# EAGLE design madaq_filter_panel (EAGLE 7.2.0)
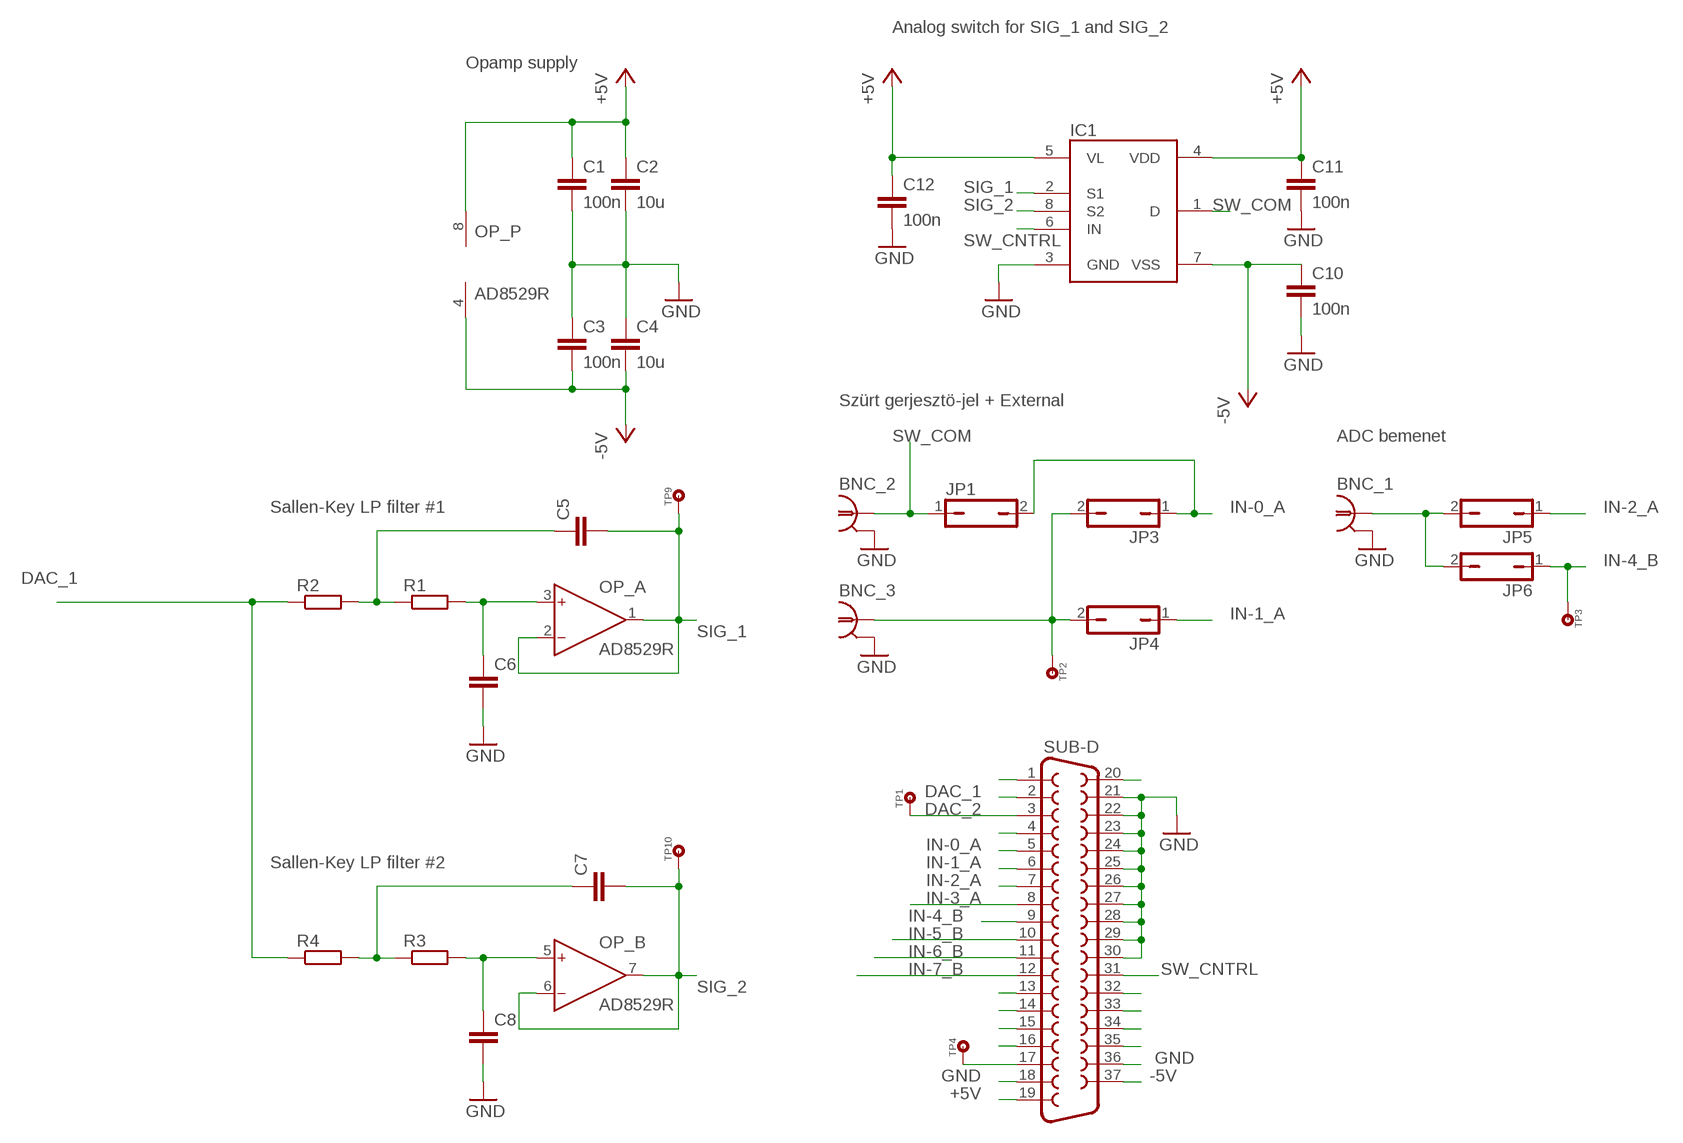
[diagram p0: schematic, sheet 1]

## Parts
BNC_1  BNC-ISOL-90I  [BNCPCB90I]
BNC_2  BNC-ISOL-90I  [BNCPCB90I]
BNC_3  BNC-ISOL-90I  [BNCPCB90I]
C1  100n  C1206  [C1206]
C2  10u  C1206  [C1206]
C3  100n  C1206  [C1206]
C4  10u  C1206  [C1206]
C5  C1206  [C1206]
C6  C1206  [C1206]
C7  C1206  [C1206]
C8  C1206  [C1206]
C10  100n  C1206  [C1206]
C11  100n  C1206  [C1206]
C12  100n  C1206  [C1206]
IC1  ADG419BR  [SO08]
JP1  JP1Q  [JP1]
JP3  JP1Q  [JP1]
JP4  JP1Q  [JP1]
JP5  JP1Q  [JP1]
JP6  JP1Q  [JP1]
OP_  AD8529R  [SO8]
R1  R1206  [R1206]
R2  R1206  [R1206]
R3  R1206  [R1206]
R4  R1206  [R1206]
SUB-D  F37HP  [F37HP]
TP1  TP  [JP1]
TP2  TP  [JP1]
TP3  TP  [JP1]
TP4  TP  [JP1]
TP9  TP  [JP1]
TP10  TP  [JP1]

## Nets
+5V: C1.2 C2.2 C11.2 C12.2 IC1.4(VDD) IC1.5(VL) OP_.8(P:V+) SUB-D.19
-5V: C3.1 C4.1 C10.2 IC1.7(VSS) OP_.4(P:V-) SUB-D.37
DAC_1: R2.1 R4.1 SUB-D.2
DAC_2: SUB-D.3 TP1.1
GND: BNC_1.SHIELD BNC_2.SHIELD BNC_3.SHIELD C1.1 C2.1 C3.2 C4.2 C6.1 C8.1 C10.1 C11.1 C12.1 IC1.3(GND) SUB-D.18 SUB-D.21 SUB-D.22 SUB-D.23 SUB-D.24 SUB-D.25 SUB-D.26 SUB-D.27 SUB-D.28 SUB-D.29 SUB-D.30 SUB-D.36
IN-0_A: JP1.2 JP3.1 SUB-D.5
IN-1_A: JP4.1 SUB-D.6
IN-2_A: JP5.1 SUB-D.7
IN-3_A: SUB-D.8
IN-4_B: JP6.1 SUB-D.9 TP3.1
IN-5_B: SUB-D.10
IN-6_B: SUB-D.11
IN-7_B: SUB-D.12
N$1: C7.2 R3.1 R4.2
N$3: C8.2 OP_.5(B:IN+) R3.2
N$4: C5.2 R1.1 R2.2
N$5: C6.2 OP_.3(A:IN+) R1.2
N$8: BNC_1.SIGNAL JP5.2 JP6.2
N$9: BNC_3.SIGNAL JP3.2 JP4.2 TP2.1
N$10: SUB-D.1
N$13: SUB-D.4
N$22: SUB-D.13
N$23: SUB-D.14
N$24: SUB-D.15
N$25: SUB-D.16
N$26: SUB-D.17 TP4.1
N$29: SUB-D.20
N$41: SUB-D.32
N$42: SUB-D.33
N$43: SUB-D.34
N$44: SUB-D.35
SIG_1: C5.1 IC1.2(S1) OP_.1(A:OUT) OP_.2(A:IN-) TP9.1
SIG_2: C7.1 IC1.8(S2) OP_.6(B:IN-) OP_.7(B:OUT) TP10.1
SW_CNTRL: IC1.6(IN) SUB-D.31
SW_COM: BNC_2.SIGNAL IC1.1(D) JP1.1

## Notes on the sheet
- Analog switch for SIG_1 and SIG_2
- Opamp supply
- Szürt gerjesztö-jel + External
- ADC bemenet
- Sallen-Key LP filter #1
- Sallen-Key LP filter #2

## Library data of the parts
BNC_1-BNC_3 = Zoli2_2015-01-28:BNC-ISOL: Isolated BNC connector
C1-C8 C10-C12 = Zoli2_2015-01-28:C: Capacitor
IC1 = MRobi:ADG419
JP1 JP3-JP6 = jumper:JP1Q: JUMPER
OP_ = analog-devices:AD8529: 8 MHz Rail-to-Rail Operational Amplifiers Source: http://www.analog.com/static/imported-files/data_sheets/AD8519_8529.pdf; MF: ALTERA CORPORATION; MPN: AD8529ARZ; OC_FARNELL: unknown; OC_NEWARK: 59K6807
R1-R4 = Zoli2_2015-01-28:R: Resistor
SUB-D = con-subd:F37: SUB-D; OC_FARNELL: unknown; OC_NEWARK: unknown
TP1-TP4 TP9 TP10 = MRobi:TP: Test Pin

## Board
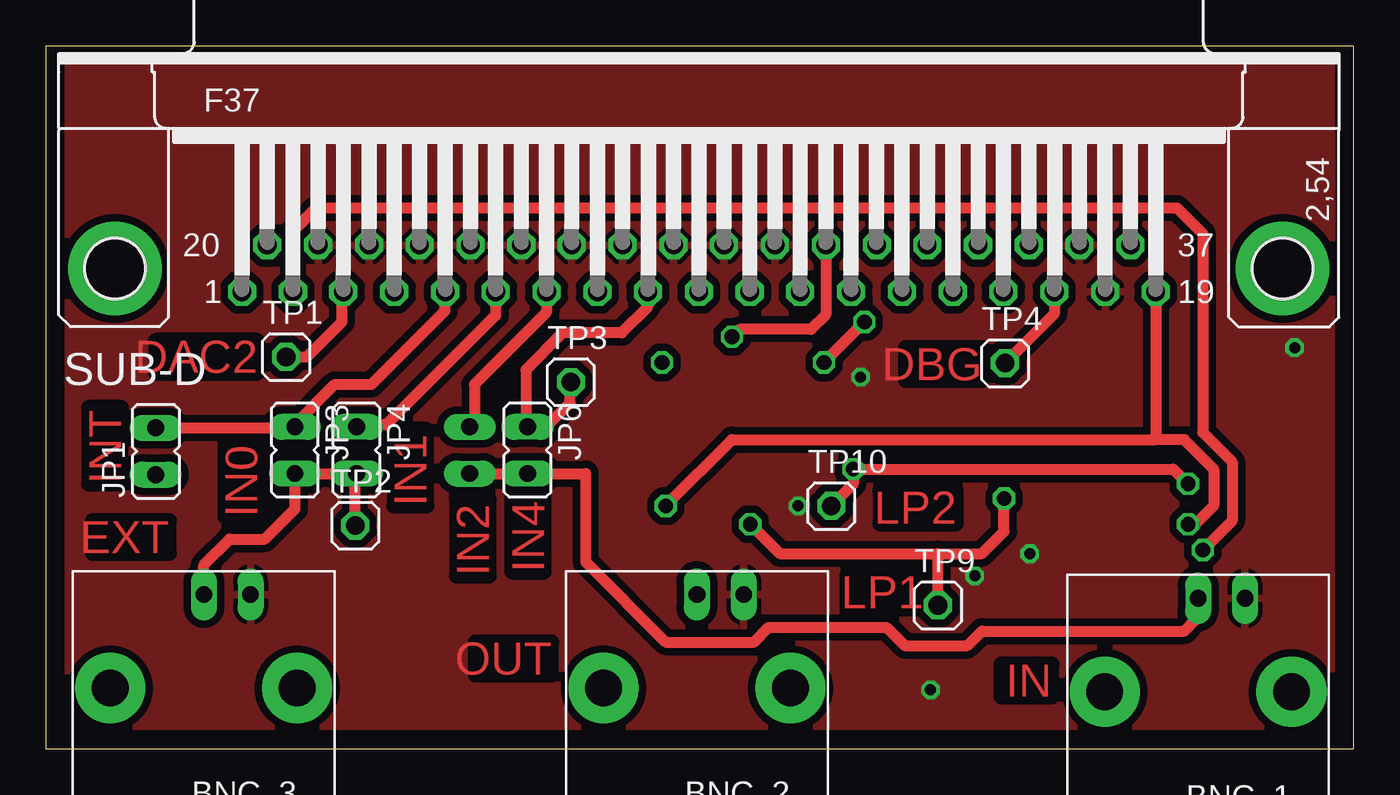
[diagram p1: board, top side]
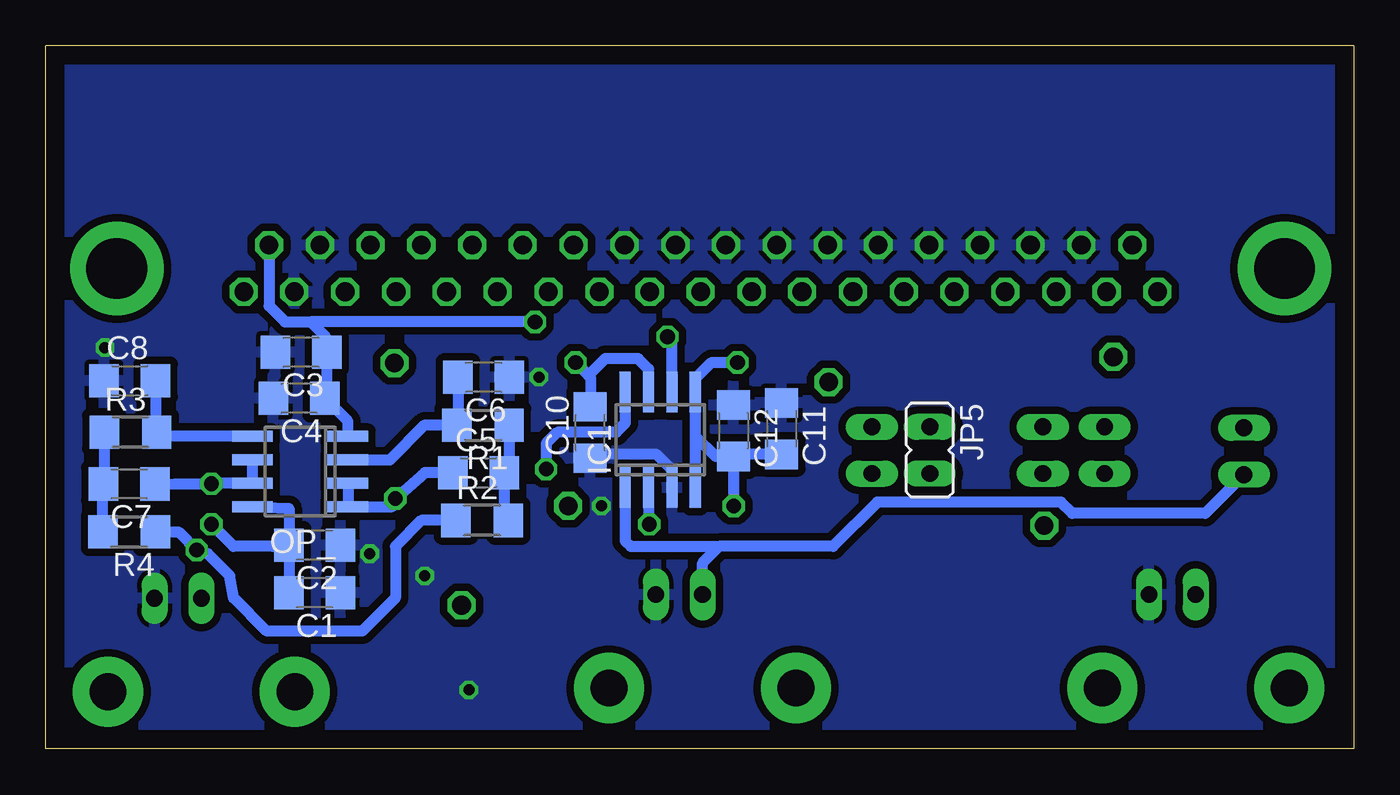
[diagram p2: board, bottom side, seen from below]

Size 71.1 x 38.2 mm. Coordinates in mm from the lower left corner, seen from the top.
Outline: 0,0 71.1,0 71.1,38.2 0,38.2 0,0
Copper layers (1*16): Top 0.035mm / dielectric 1.5mm / Bottom 0.035mm
Design rules "default": minimum track width 10mil, minimum drill 24mil, track to track 8mil, track to pad 8mil, pad to pad 8mil, via to via 8mil, smd to smd 8mil, copper to edge 40mil, drill to drill 8mil, minimum pad ring 10mil, minimum via ring 8mil, stop-mask expansion 4mil, vias tented up to drill 0mil, thermal gap 10mil

### Footprints (pad centres in the part's own frame; a part is rotated, then mirrored left to right if it is on the bottom)
BNCPCB90I = drill 2 pad 3.81: P$1 -5.08,0; P$2 5.08,0 | drill 0.9 long: SHIELD -2.54,-5.08; SIGNAL 0,-5.08
C1206 = smd 1.6 x 1.8: 1 -1.4,0; 2 1.4,0
SO08 = smd 0.6 x 2.2: 1 -1.905,-2.6; 2 -0.635,-2.6; 3 0.635,-2.6; 4 1.905,-2.6; 5 1.905,2.6; 6 0.635,2.6; 7 -0.635,2.6; 8 -1.905,2.6
JP1 = drill 0.914 long: 1 0,-1.27; 2 0,1.27
SO8 = smd 0.6 x 2.2: 1 -1.905,-2.6; 2 -0.635,-2.6; 3 0.635,-2.6; 4 1.905,-2.6; 5 1.905,2.6; 6 0.635,2.6; 7 -0.635,2.6; 8 -1.905,2.6
R1206 = smd 1.6 x 1.803: 1 -1.422,0; 2 1.422,0
F37HP = drill 1.016 octagon: 1 -24.841,-1.27; 2 -22.073,-1.27; 3 -19.329,-1.27; 4 -16.561,-1.27; 5 -13.792,-1.27; 6 -11.049,-1.27; 7 -8.28,-1.27; 8 -5.512,-1.27; 9 -2.769,-1.27; 10 0,-1.27; 11 2.769,-1.27; 12 5.512,-1.27; 13 8.28,-1.27; 14 11.049,-1.27; 15 13.818,-1.27; 16 16.561,-1.27; 17 19.329,-1.27; 18 22.098,-1.27; 19 24.841,-1.27; 20 -23.47,1.27; 21 -20.701,1.27; 22 -17.932,1.27; 23 -15.189,1.27; 24 -12.421,1.27; 25 -9.652,1.27; 26 -6.909,1.27; 27 -4.14,1.27; 28 -1.372,1.27; 29 1.372,1.27; 30 4.14,1.27; 31 6.909,1.27; 32 9.677,1.27; 33 12.421,1.27; 34 15.189,1.27; 35 17.958,1.27; 36 20.701,1.27; 37 23.47,1.27 | drill 3.302 pad 5.08: G1 -31.75,0; G2 31.75,0
JP1' = drill 1.016 octagon: 1 0,0

### Placement (x,y rotation side)
BNC_1  62.65,3.1 180 top
BNC_2  35.4,3.3 180 top
BNC_3  8.58,3.3 180 top
C1  56.5,8.47 180 bottom
C2  56.48,11.07 180 bottom
C3  57.23,21.55 180 bottom
C4  57.34,19.05 180 bottom
C5  47.58,15.01 0 bottom
C6  47.3,20.19 180 bottom
C7  66.58,14.39 180 bottom
C8  66.54,20.01 0 bottom
C10  41.51,17.19 90 bottom
C11  31.1,17.4 270 bottom
C12  33.72,17.28 270 bottom
IC1  37.7,16.8 0 bottom
JP1  5.96,16.17 0 top
JP3  13.54,16.23 180 top
JP4  16.89,16.23 180 top
JP5  23.04,16.23 180 bottom
JP6  26.19,16.23 180 top
OP_  57.28,15.07 90 bottom
R1  47.34,17.59 180 bottom
R2  47.38,12.41 0 bottom
R3  66.5,17.21 0 bottom
R4  66.58,11.79 180 bottom
SUB-D  35.5,26.11 0 top
TP1  TP  [JP1']  13.06,21.3 0 top
TP2  TP  [JP1']  16.82,12.13 0 top
TP3  TP  [JP1']  28.54,19.93 0 top
TP4  TP  [JP1']  52.15,20.96 0 top
TP9  TP  [JP1']  48.5,7.8 0 top
TP10  TP  [JP1']  42.7,13.2 0 top

### Tracks (layer width: path | path; a pad name or v marks a point on that pad's centre or on a via)
+5V  (via drill 0.8)
  Top 0.61: v33.7,13.2 37.3,16.8 60.1,16.8 60.34,16.8 | v62.1,12.2 62.5,12.2 63.5,13.2 63.5,15.2 61.9,16.8 60.34,16.8 | SUB-D.19 60.34,16.8
  Bottom 0.61: OP_.8 57.88,13.07 C2.2 | C2.2 57.88,8.49 C1.2 | C2.2 58.75,11 60.9,11 v62.1,12.2 | 35.8,17 IC1.5 35.8,20.1 34.9,21 v33.5,21 | 35.8,17 IC1.4 | C11.2 33.64,16 C12.2 | C12.2 34.67,15.88 35.8,17 | v33.7,13.2 33.7,15.86 C12.2
-5V  (via drill 0.8)
  Top 0.61: v44.5,23.2 v42.3,21
  Bottom 0.61: OP_.4 54.68,17.79 C4.1 55.83,19.16 C3.1 55.9,21.62 55.9,22.4 56.7,23.2 | SUB-D.37 58.97,24.07 58.1,23.2 56.7,23.2 | v44.5,23.2 56.7,23.2 | 41.6,20.3 41.5,20.2 C10.2 | IC1.7 38.33,20.63 38.9,21.2 40.7,21.2 41.6,20.3 | v42.3,21 41.6,20.3
DAC_1  (via drill 0.8)
  Top 0.61: SUB-D.2 13.43,28.13 14.7,29.4 61.5,29.4 62.9,28 62.9,17.2 64.5,15.6 64.5,12.4 v62.9,10.8
  Bottom 0.61: R2.1 50.69,12.41 52.1,11 52.1,8.2 53.9,6.4 59.1,6.4 60.9,8.2 61.1,9.4 62.3,10.6 v62.9,10.8 63.89,11.79 R4.1
DAC_2
  Top 0.61: TP1.1 14.2,21.3 16.1,23.2 16.1,24.77 SUB-D.3
GND  (via drill 0.6)
  Bottom 0.61: IC1.3 37.06,15.16 37.9,16 41.3,16 C10.1
  other vias: 50.5,9.4 53.5,10.6 40.9,13.2 44.3,20.2 48.1,3.2 67.9,21.8
  pour Bottom (isolate 0.406): 0.3,38 70.7,38 70.7,0.2 0.3,0.2
  pour Top (isolate 0.406): 0.1,38 70.9,38 70.9,0.2 0.1,0.2
IN-0_A
  Top 0.61: JP1.2 13.48,17.44 JP3.1 13.54,17.64 15.7,19.8 17.7,19.8 21.7,23.8 SUB-D.5
IN-1_A
  Top 0.61: SUB-D.6 24.45,23.55 18.5,17.6 16.99,17.6 JP4.1
IN-2_A
  Top 0.61: SUB-D.7 27.22,23.72 23.3,19.8 23.3,17.56 JP5.1
IN-4_B
  Top 0.61: TP3.1 28.5,19.89 28.5,18.8 27.2,17.5 JP6.1 26.1,17.59 26.1,20.6 28.1,22.6 31.3,22.6 32.73,24.03 SUB-D.9
N$1
  Bottom 0.61: R3.1 67.92,14.45 C7.2 68,14.37 R4.2
N$3
  Bottom 0.61: C8.2 65.14,17.07 R3.2 65.44,16.97 OP_.5
N$4
  Bottom 0.61: R1.1 45.92,15.07 C5.2 46.18,12.43 R2.2
N$5
  Bottom 0.61: C6.2 48.7,17.65 R1.2 48.77,17.6 50.5,17.6 52.39,15.7 OP_.3
N$8
  Top 0.61: JP5.2 JP6.2 29.34,14.96 29.34,10.16 33.7,5.8 38.5,5.8 39.3,6.6 45.7,6.6 46.7,5.6 50.1,5.6 50.9,6.4 61.9,6.4 62.5,7 62.5,8.03 BNC_1.SIGNAL
N$9
  Top 0.61: BNC_3.SIGNAL 8.58,10 9.98,11.4 11.9,11.4 13.54,13.04 JP3.2 JP4.2 16.82,14.89 TP2.1
N$26
  Top 0.61: SUB-D.17 54.83,23.64 TP4.1
SIG_1  (via drill 0.8)
  Top 0.61: 48.5,10.6 39.9,10.6 v38.3,12.2 | 48.5,10.6 50.9,10.6 52.1,11.8 v52.1,13.6 | TP9.1 48.5,10.6
  Bottom 0.61: 54.64,14.4 OP_.2 OP_.1 52.27,13.16 v52.1,13.6 50.49,15.01 C5.1 | IC1.2 38.33,12.23 v38.3,12.2
SIG_2  (via drill 0.8)
  Top 0.61: v62.1,14.4 61.3,15.2 v43.9,15.2 43.9,14.4 TP10.1
  Bottom 0.61: OP_.6 OP_.7 62.06,14.43 v62.1,14.4 64.1,14.4 64.49,14.39 C7.1 65.53,14.43 | IC1.8 39.61,17.7 40.1,17.2 43.3,17.2 43.9,16.6 v43.9,15.2
SW_CNTRL  (via drill 0.8)
  Top 0.61: SUB-D.31 42.41,23.6 41.61,22.8 37.7,22.8 v37.3,22.4
  Bottom 0.61: IC1.6 37.06,22.16 v37.3,22.4
SW_COM
  Bottom 0.61: JP1.1 8.06,12.8 15.3,12.8 15.9,13.4 25.9,13.4 28.3,11 34.5,11 | IC1.1 39.61,11.3 39.3,11 34.5,11 | BNC_2.SIGNAL 35.4,10.1 34.5,11

### Text on the board
Top: DAC2 | DBG | INT | LP2 | EXT | IN0 | IN1 | IN2 | IN4 | LP1 | OUT | IN